# EAGLE design schematic (EAGLE 5.06)
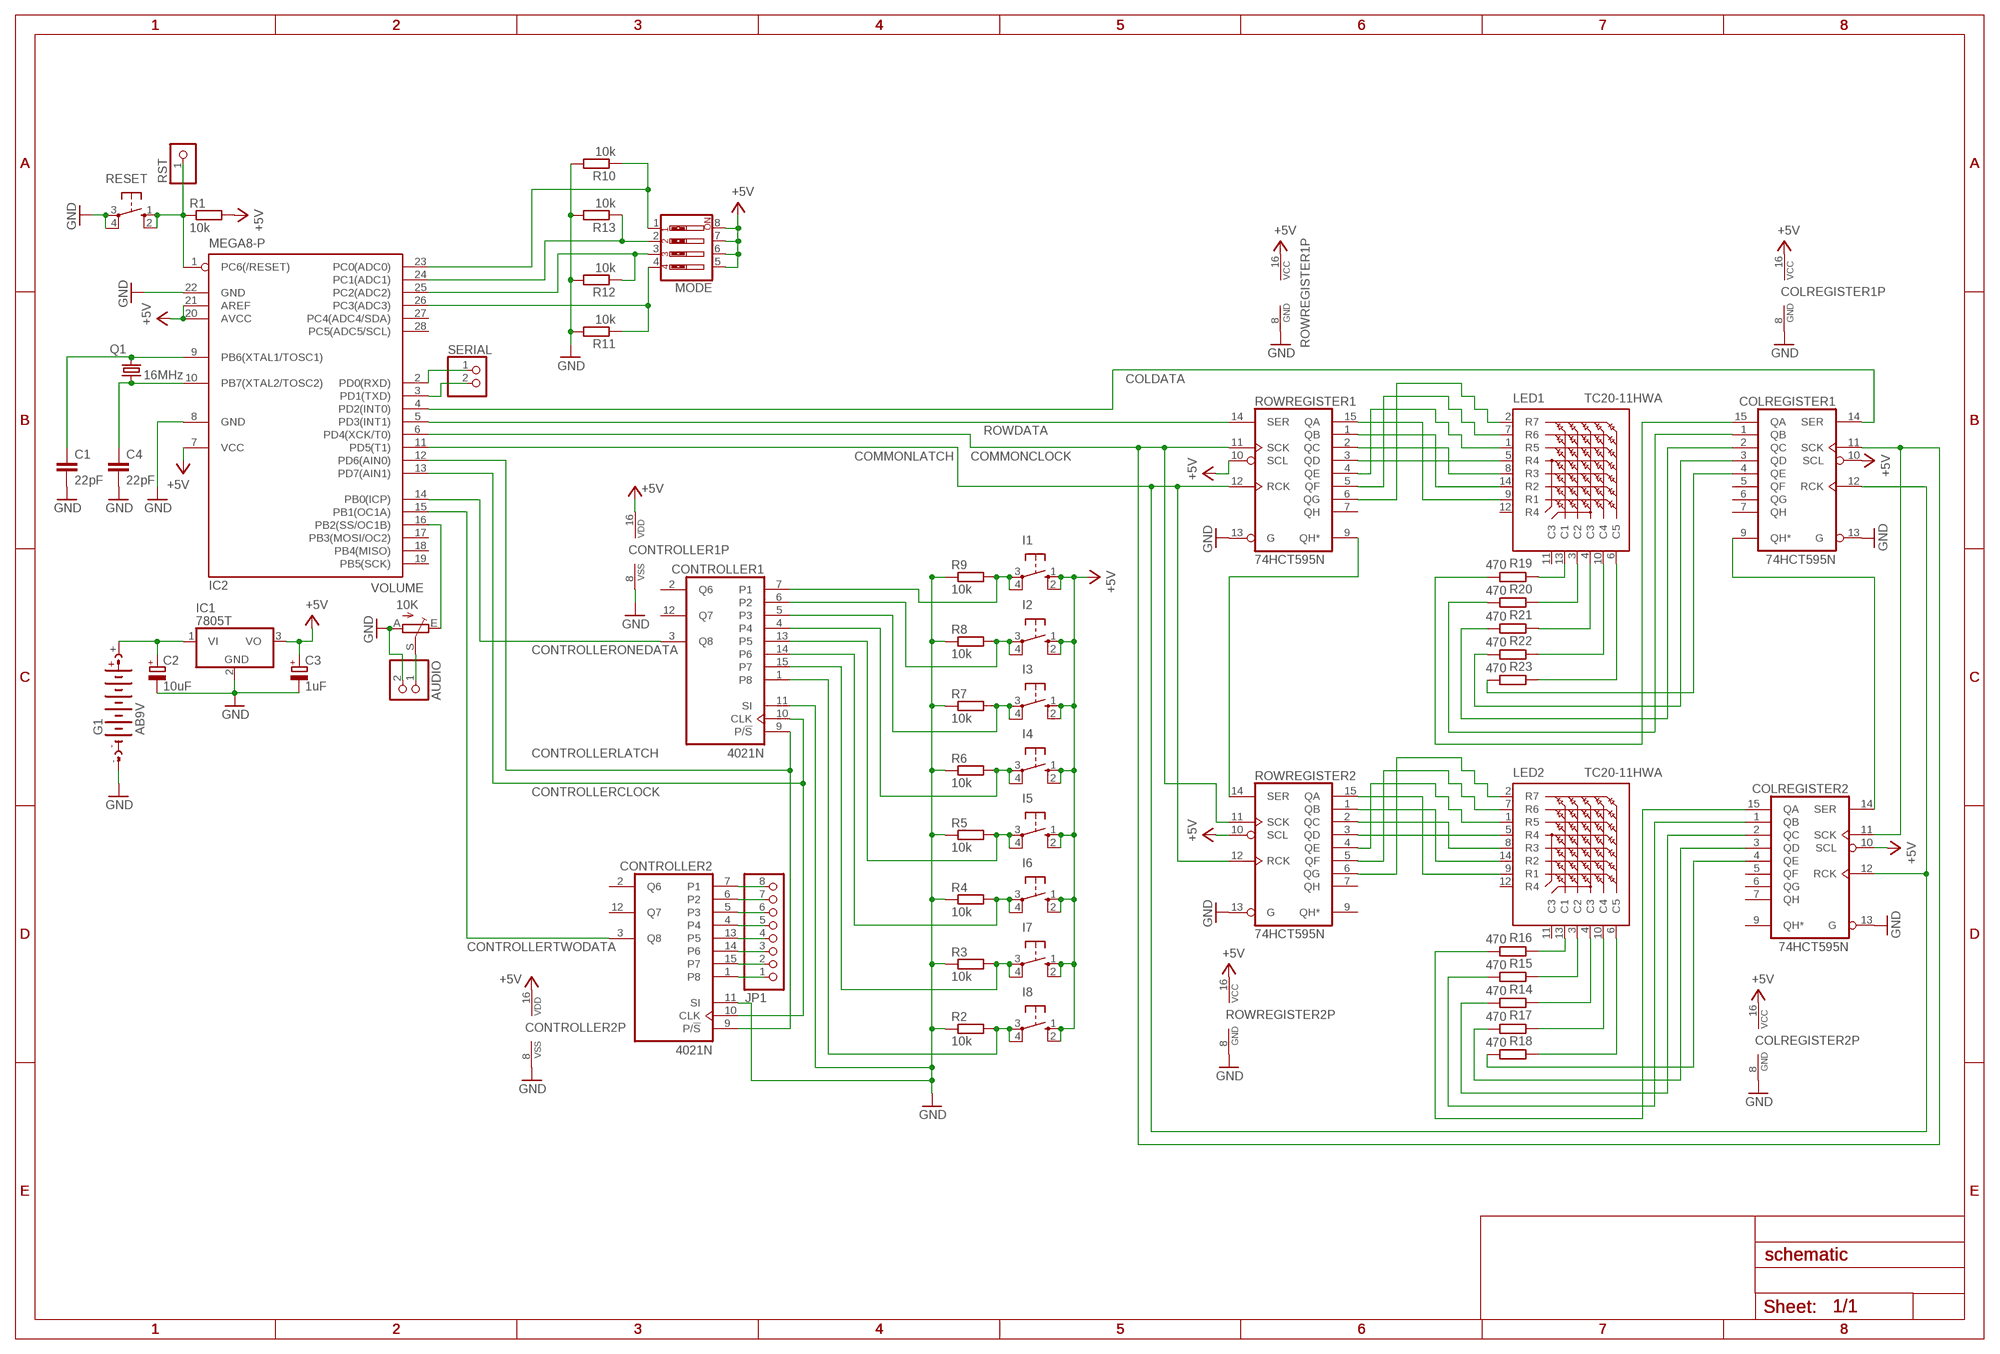
[diagram p0: schematic, sheet 1]

## Parts
AUDIO  PINHD-1X2  [1X02]
C1  22pF  C2,5-3  [C2.5-3]
C2  10uF  CPOL-EUB45181A  [B45181A]
C3  1uF  CPOL-EUB45181A  [B45181A]
C4  22pF  C2,5-3  [C2.5-3]
COLREGISTER1  74HCT595N  [DIL16]
COLREGISTER2  74HCT595N  [DIL16]
CONTROLLER1  4021N  [DIL16]
CONTROLLER2  4021N  [DIL16]
G1  AB9V  [AB9V]
I1  10-XX  [B3F-10XX]
I2  10-XX  [B3F-10XX]
I3  10-XX  [B3F-10XX]
I4  10-XX  [B3F-10XX]
I5  10-XX  [B3F-10XX]
I6  10-XX  [B3F-10XX]
I7  10-XX  [B3F-10XX]
I8  10-XX  [B3F-10XX]
IC1  7805T  [TO220H]
IC2  MEGA8-P  [DIL28-3]
JP1  PINHD-1X8  [1X08]
LED1  TC20-11HWA  [TA20-11HWA]
LED2  TC20-11HWA  [TA20-11HWA]
MODE  SW_DIP-4  [EDG-04]
Q1  16MHz  CRYSTALHC49U70  [HC49U70]
R1  10k  R-EU_0204/7  [0204/7]
R2  10k  R-EU_0204/7  [0204/7]
R3  10k  R-EU_0204/7  [0204/7]
R4  10k  R-EU_0204/7  [0204/7]
R5  10k  R-EU_0204/7  [0204/7]
R6  10k  R-EU_0204/7  [0204/7]
R7  10k  R-EU_0204/7  [0204/7]
R8  10k  R-EU_0204/7  [0204/7]
R9  10k  R-EU_0204/7  [0204/7]
R10  10k  R-EU_0204/7  [0204/7]
R11  10k  R-EU_0204/7  [0204/7]
R12  10k  R-EU_0204/7  [0204/7]
R13  10k  R-EU_0204/7  [0204/7]
R14  470  R-EU_0204/7  [0204/7]
R15  470  R-EU_0204/7  [0204/7]
R16  470  R-EU_0204/7  [0204/7]
R17  470  R-EU_0204/7  [0204/7]
R18  470  R-EU_0204/7  [0204/7]
R19  470  R-EU_0204/7  [0204/7]
R20  470  R-EU_0204/7  [0204/7]
R21  470  R-EU_0204/7  [0204/7]
R22  470  R-EU_0204/7  [0204/7]
R23  470  R-EU_0204/7  [0204/7]
RESET  10-XX  [B3F-10XX]
ROWREGISTER1  74HCT595N  [DIL16]
ROWREGISTER2  74HCT595N  [DIL16]
RST  PINHD-1X1  [1X01]
SERIAL  PINHD-1X2  [1X02]
VOLUME  10K  TRIM_EU-S63S  [S63S]

## Nets
AUDIO: AUDIO.1 VOLUME.S
COLDATA: COLREGISTER1.14(SER) IC2.4(PD2(INT0))
COMMONCLOCK: COLREGISTER1.11(SCK) COLREGISTER2.11(SCK) IC2.6(PD4(XCK/T0)) ROWREGISTER1.11(SCK) ROWREGISTER2.11(SCK)
COMMONLATCH: COLREGISTER1.12(RCK) COLREGISTER2.12(RCK) IC2.11(PD5(T1)) ROWREGISTER1.12(RCK) ROWREGISTER2.12(RCK)
CONTROLLERCLOCK: CONTROLLER1.10(CLK) CONTROLLER2.10(CLK) IC2.13(PD7(AIN1))
CONTROLLERLATCH: CONTROLLER1.9(P/!S) CONTROLLER2.9(P/!S) IC2.12(PD6(AIN0))
CONTROLLERONEDATA: CONTROLLER1.3(Q8) IC2.14(PB0(ICP))
CONTROLLERTWODATA: CONTROLLER2.3(Q8) IC2.15(PB1(OC1A))
GND: AUDIO.2 C1.2 C2.- C3.- C4.2 COLREGISTER1.8(GND) COLREGISTER1.13(G) COLREGISTER2.8(GND) COLREGISTER2.13(G) CONTROLLER1.8(VSS) CONTROLLER1.11(SI) CONTROLLER2.8(VSS) CONTROLLER2.11(SI) G1.- IC1.2(GND) IC2.8(GND) IC2.22(GND) R2.1 R3.1 R4.1 R5.1 R6.1 R7.1 R8.1 R9.1 R10.2 R11.2 R12.2 R13.2 RESET.3(P) RESET.4(P1) ROWREGISTER1.8(GND) ROWREGISTER1.13(G) ROWREGISTER2.8(GND) ROWREGISTER2.13(G) VOLUME.A
N$1: C1.1 IC2.9(PB6(XTAL1/TOSC1)) Q1.2
N$2: C2.+ G1.+ IC1.1(VI)
N$3: C4.1 IC2.10(PB7(XTAL2/TOSC2)) Q1.1
N$4: LED2.6(C5) R18.1
N$5: IC2.2(PD0(RXD)) SERIAL.1
N$6: CONTROLLER2.7(P1) JP1.8
N$7: CONTROLLER2.6(P2) JP1.7
N$8: CONTROLLER2.5(P3) JP1.6
N$9: CONTROLLER2.4 JP1.5
N$10: CONTROLLER2.13(P5) JP1.4
N$11: CONTROLLER2.14(P6) JP1.3
N$12: CONTROLLER1.1(P8) I8.3(P) I8.4(P1) R2.2
N$13: CONTROLLER1.15(P7) I7.3(P) I7.4(P1) R3.2
N$14: CONTROLLER1.14(P6) I6.3(P) I6.4(P1) R4.2
N$15: CONTROLLER1.13(P5) I5.3(P) I5.4(P1) R5.2
N$16: CONTROLLER1.4 I4.3(P) I4.4(P1) R6.2
N$17: CONTROLLER1.5(P3) I3.3(P) I3.4(P1) R7.2
N$18: CONTROLLER1.6(P2) I2.3(P) I2.4(P1) R8.2
N$19: CONTROLLER1.7(P1) I1.3(P) I1.4(P1) R9.2
N$20: CONTROLLER2.15(P7) JP1.2
N$21: CONTROLLER2.1(P8) JP1.1
N$22: ROWREGISTER1.9(QH*) ROWREGISTER2.14(SER)
N$23: LED2.10(C4) R17.1
N$24: LED2.4(C3) R14.1
N$25: LED2.3(C2) R15.1
N$26: LED1.9(R1) ROWREGISTER1.15(QA)
N$27: LED1.14(R2) ROWREGISTER1.1(QB)
N$28: LED1.8(R3) ROWREGISTER1.2(QC)
N$29: LED1.5(R4) ROWREGISTER1.3(QD)
N$30: LED1.1(R5) ROWREGISTER1.4(QE)
N$31: LED1.7(R6) ROWREGISTER1.5(QF)
N$32: LED1.2(R7) ROWREGISTER1.6(QG)
N$33: LED2.9(R1) ROWREGISTER2.15(QA)
N$34: LED2.14(R2) ROWREGISTER2.1(QB)
N$35: LED2.8(R3) ROWREGISTER2.2(QC)
N$36: LED2.5(R4) ROWREGISTER2.3(QD)
N$37: LED2.1(R5) ROWREGISTER2.4(QE)
N$38: LED2.7(R6) ROWREGISTER2.5(QF)
N$39: LED2.2(R7) ROWREGISTER2.6(QG)
N$40: COLREGISTER1.9(QH*) COLREGISTER2.14(SER)
N$41: LED2.13(C1) R16.1
N$42: LED1.13(C1) R19.1
N$43: LED1.3(C2) R20.1
N$44: COLREGISTER1.15(QA) R19.2
N$45: COLREGISTER1.1(QB) R20.2
N$46: COLREGISTER1.2(QC) R21.2
N$47: COLREGISTER1.3(QD) R22.2
N$48: COLREGISTER1.4(QE) R23.2
N$49: COLREGISTER2.4(QE) R18.2
N$50: COLREGISTER2.3(QD) R17.2
N$51: COLREGISTER2.2(QC) R14.2
N$52: COLREGISTER2.1(QB) R15.2
N$53: COLREGISTER2.15(QA) R16.2
N$54: LED1.4(C3) R21.1
N$55: LED1.10(C4) R22.1
N$56: LED1.6(C5) R23.1
N$57: IC2.3(PD1(TXD)) SERIAL.2
N$61: IC2.23(PC0(ADC0)) MODE.1 R10.1
N$62: IC2.24(PC1(ADC1)) MODE.2 R13.1
N$63: IC2.25(PC2(ADC2)) MODE.3 R12.1
N$64: IC2.26(PC3(ADC3)) MODE.4 R11.1
N$65: IC2.16(PB2(SS/OC1B)) VOLUME.E
NOTHING: IC2.1(PC6(/RESET)) R1.1 RESET.1(S) RESET.2(S1) RST.1
ROWDATA: IC2.5(PD3(INT1)) ROWREGISTER1.14(SER)
V+: C3.+ COLREGISTER1.10(SCL) COLREGISTER1.16(VCC) COLREGISTER2.10(SCL) COLREGISTER2.16(VCC) CONTROLLER1.16(VDD) CONTROLLER2.16(VDD) I1.1(S) I1.2(S1) I2.1(S) I2.2(S1) I3.1(S) I3.2(S1) I4.1(S) I4.2(S1) I5.1(S) I5.2(S1) I6.1(S) I6.2(S1) I7.1(S) I7.2(S1) I8.1(S) I8.2(S1) IC1.3(VO) IC2.7(VCC) IC2.20(AVCC) IC2.21(AREF) MODE.5 MODE.6 MODE.7 MODE.8 R1.2 ROWREGISTER1.10(SCL) ROWREGISTER1.16(VCC) ROWREGISTER2.10(SCL) ROWREGISTER2.16(VCC) ; supply symbol labelled +5V
Unconnected: COLREGISTER1.5(QF) COLREGISTER1.6(QG) COLREGISTER1.7(QH) COLREGISTER2.5(QF) COLREGISTER2.6(QG) COLREGISTER2.7(QH) COLREGISTER2.9(QH*) CONTROLLER1.2(Q6) CONTROLLER1.12(Q7) CONTROLLER2.2(Q6) CONTROLLER2.12(Q7) IC2.17(PB3(MOSI/OC2)) IC2.18(PB4(MISO)) IC2.19(PB5(SCK)) IC2.27(PC4(ADC4/SDA)) IC2.28(PC5(ADC5/SCL)) LED1.11(C3) LED1.12(R4) LED2.11(C3) LED2.12(R4) ROWREGISTER1.7(QH) ROWREGISTER2.7(QH) ROWREGISTER2.9(QH*)

## Library data of the parts
AUDIO SERIAL = pinhead:PINHD-1X2: PIN HEADER
C1 C4 = capacitor-wima:C: CAPACITOR naming: grid - package width
C2 C3 = resistor:CPOL-EU: POLARIZED CAPACITOR, European symbol
COLREGISTER1 COLREGISTER2 ROWREGISTER1 ROWREGISTER2 = 74xx-eu:74*595: 8-bit SHIFT REGISTER, output latch
CONTROLLER1 CONTROLLER2 = 40xx:4021: 8-bit static SHIFT REGISTER
G1 = battery:AB9V: 9-V BATTERY CLIP
I1-I8 RESET = switch-omron:10-XX: OMRON SWITCH; MPN: B3F-1000; OC_FARNELL: 176432; OC_NEWARK: 36M3542
IC1 = linear:78*: Positive VOLTAGE REGULATOR Source: http://cache.national.com/ds/LM/LM78L05.pdf http://www.fairchildsemi.com/ds/LM/LM7805.pdf
IC2 = atmel:MEGA8-P: MICROCONTROLLER 8 Kbytes FLASH, 1 kbytes SRAM, 512 bytes EEPROM, USART, 4-channel 10 bit ADC, 2-channel 8 bit ADC Pin compatible with Atmega48, ATMega88, ATMega168 Source: avr.lbr; OC_FARNELL: unknown; OC_NEWARK: unknown
JP1 = pinhead:PINHD-1X8: PIN HEADER
LED1 LED2 = display-kingbright:TC20-11HWA: 50mm (2.0 INCH) 5x7 DOT MATRIX DISPLAY Source: http://www.kingbright.com/manager/upload/pdf/TC20-11EWA(Ver1189410378.9); OC_FARNELL: unknown; OC_NEWARK: unknown
MODE = special:SW_DIP-4: DIP SWITCH
Q1 = crystal:CRYSTAL: CRYSTAL; OC_FARNELL: unknown; OC_NEWARK: unknown
R1-R23 = resistor:R-EU_: RESISTOR, European symbol
RST = pinhead:PINHD-1X1: PIN HEADER
VOLUME = pot:TRIM_EU-: POTENTIOMETER

## Net classes
0 default: width 0.61 mm

## Board
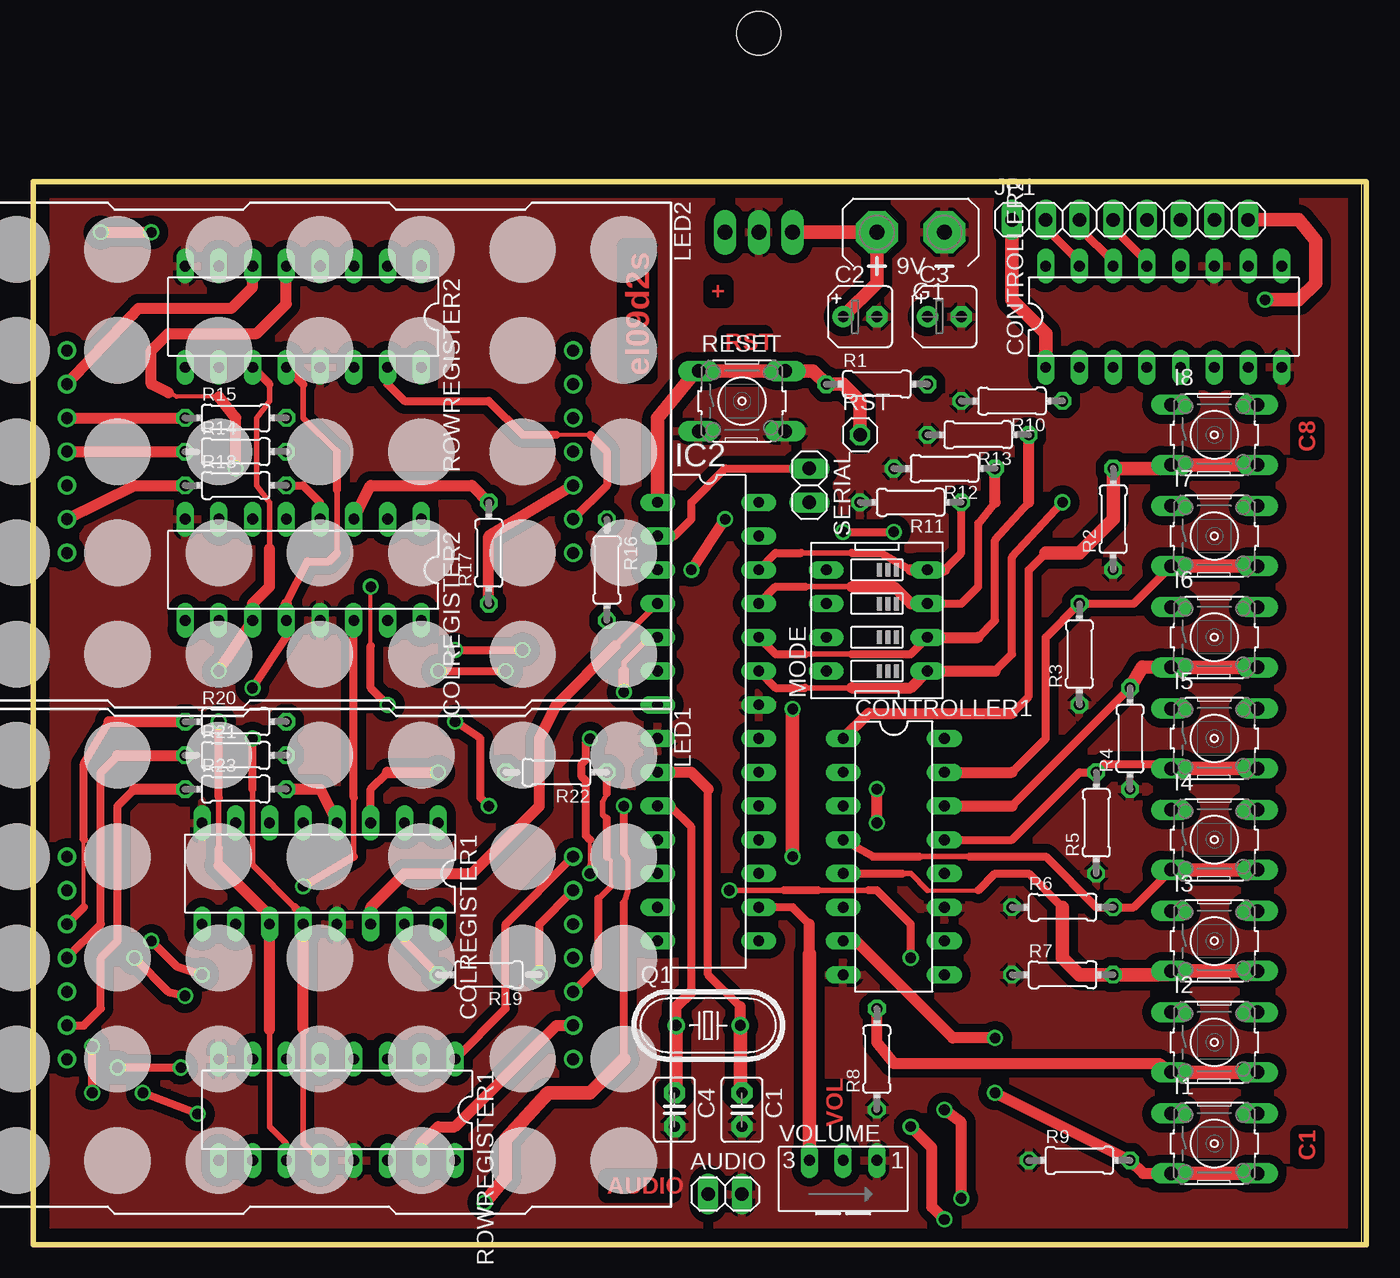
[diagram p1: board, top side]
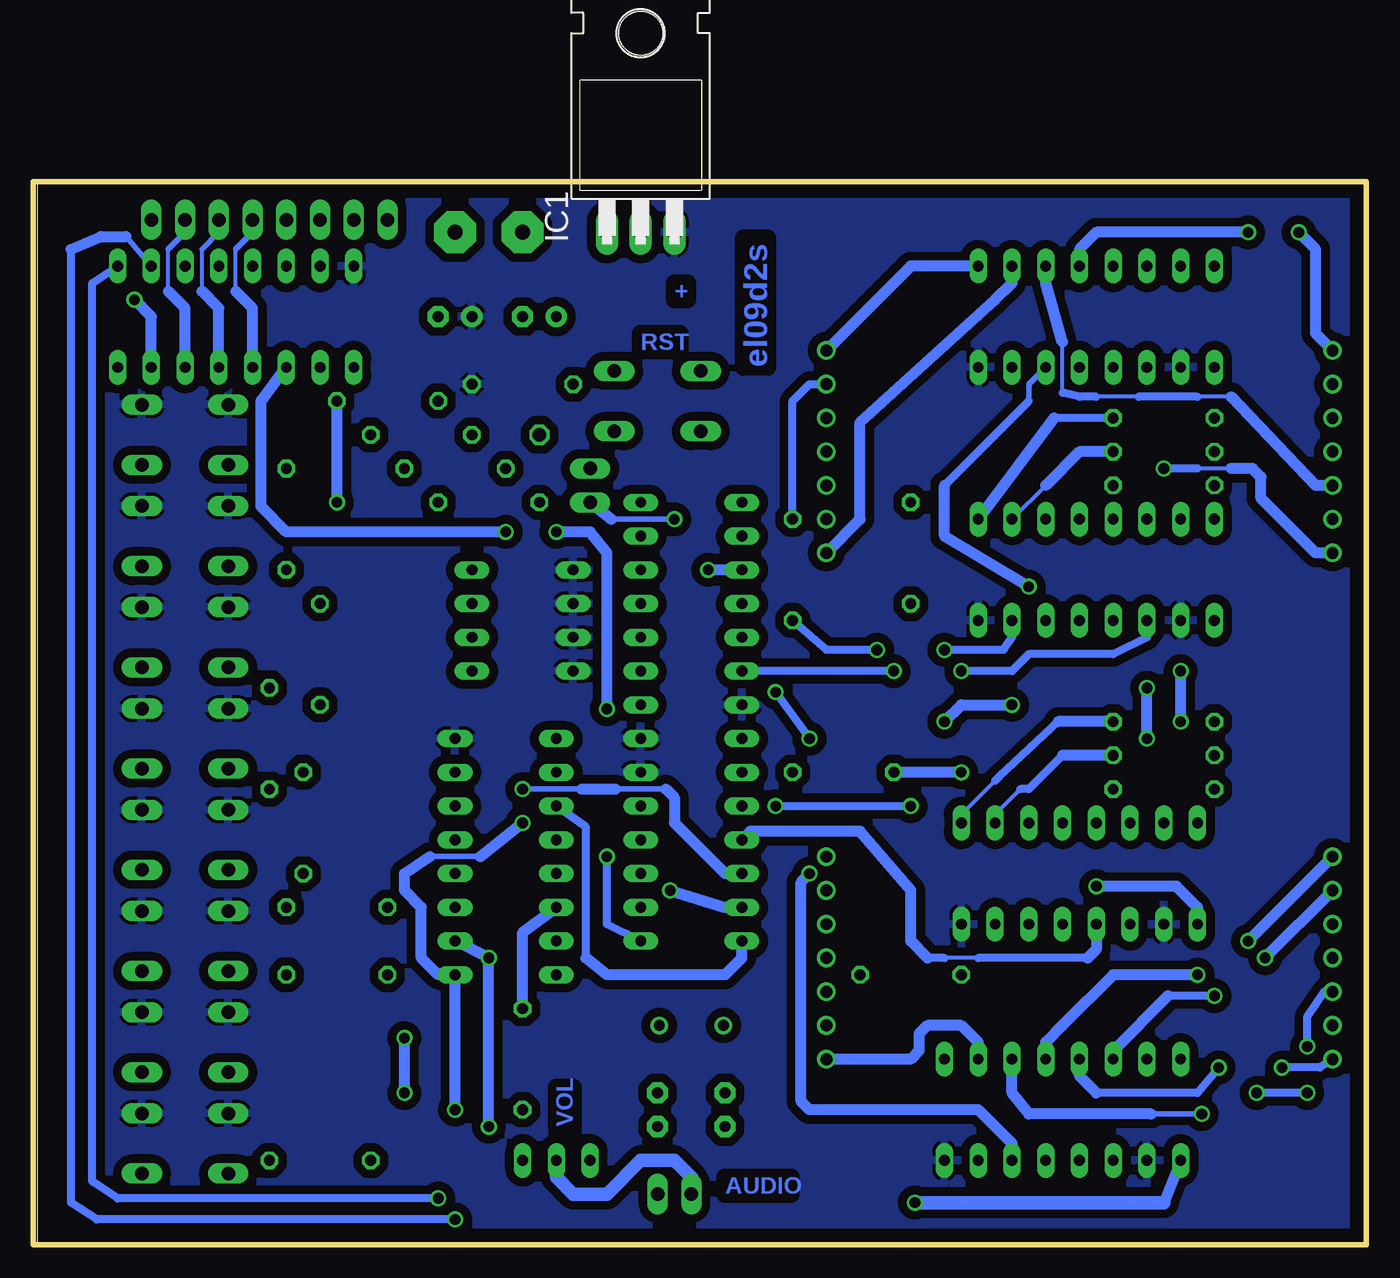
[diagram p2: board, bottom side, seen from below]

Size 100.33 x 80.01 mm. Coordinates in mm from the lower left corner, seen from the top.
Outline: 0,0 100,0 100,80 0,80
Outline: 0,80 0,80.01 100.33,80.01 100.33,0 0,0
Outline: 0,80 0,0
Copper layers (1*16): Top 0.035mm / dielectric 1.5mm / Bottom 0.035mm
Design rules "default *": minimum track width 10mil, minimum drill 24mil, track to track 26mil, track to pad 16mil, pad to pad 8mil, via to via 8mil, smd to smd 8mil, copper to edge 40mil, drill to drill 8mil, minimum pad ring 10mil, minimum via ring 8mil, stop-mask expansion 4mil, vias tented up to drill 0mil, thermal gap 10mil

### Footprints (pad centres in the part's own frame; a part is rotated, then mirrored left to right if it is on the bottom)
1X02 = drill 1.016 long: 1 -1.27,0; 2 1.27,0
C2.5-3 = drill 0.813 pad 1.6 octagon: 1 -1.27,0; 2 1.27,0
B45181A = drill 0.813 pad 1.6 round: + -1.27,0 | drill 0.813 pad 1.6 octagon: - 1.27,0
DIL16 = drill 0.813 long: 1 -8.89,-3.81; 2 -6.35,-3.81; 3 -3.81,-3.81; 4 -1.27,-3.81; 5 1.27,-3.81; 6 3.81,-3.81; 7 6.35,-3.81; 8 8.89,-3.81; 9 8.89,3.81; 10 6.35,3.81; 11 3.81,3.81; 12 1.27,3.81; 13 -1.27,3.81; 14 -3.81,3.81; 15 -6.35,3.81; 16 -8.89,3.81
AB9V = drill 1.118 pad 3.15 octagon: + 0,2.54; - 0,-2.54
B3F-10XX = drill 1.016 long: 1 -3.251,2.261; 2 3.251,2.261; 3 -3.251,-2.261; 4 3.251,-2.261
TO220H = drill 1.118 long: 1 -2.54,-10.16; 2 0,-10.16; 3 2.54,-10.16 | hole 3.302: 0,4.826
DIL28-3 = drill 0.813 long: 1 -16.51,-3.81; 2 -13.97,-3.81; 3 -11.43,-3.81; 4 -8.89,-3.81; 5 -6.35,-3.81; 6 -3.81,-3.81; 7 -1.27,-3.81; 8 1.27,-3.81; 9 3.81,-3.81; 10 6.35,-3.81; 11 8.89,-3.81; 12 11.43,-3.81; 13 13.97,-3.81; 14 16.51,-3.81; 15 16.51,3.81; 16 13.97,3.81; 17 11.43,3.81; 18 8.89,3.81; 19 6.35,3.81; 20 3.81,3.81; 21 1.27,3.81; 22 -1.27,3.81; 23 -3.81,3.81; 24 -6.35,3.81; 25 -8.89,3.81; 26 -11.43,3.81; 27 -13.97,3.81; 28 -16.51,3.81
1X08 = drill 1.016 long: 1 -8.89,0; 2 -6.35,0; 3 -3.81,0; 4 -1.27,0; 5 1.27,0; 6 3.81,0; 7 6.35,0; 8 8.89,0
TA20-11HWA = drill 0.9 pad 1.4 round: 1 -7.62,-19.05; 2 -5.08,-19.05; 3 -2.54,-19.05; 4 0,-19.05; 5 2.54,-19.05; 6 5.08,-19.05; 7 7.62,-19.05; 8 7.62,19.05; 9 5.08,19.05; 10 2.54,19.05; 11 0,19.05; 12 -2.54,19.05; 13 -5.08,19.05; 14 -7.62,19.05
EDG-04 = drill 0.813 long: 1 -3.81,-3.81; 2 -1.27,-3.81; 3 1.27,-3.81; 4 3.81,-3.81; 5 3.81,3.81; 6 1.27,3.81; 7 -1.27,3.81; 8 -3.81,3.81
HC49U70 = drill 0.813 round: 1 -2.413,0; 2 2.413,0
0204/7 = drill 0.813 octagon: 1 -3.81,0; 2 3.81,0
1X01 = drill 1.016 octagon: 1 0,0
S63S = drill 0.813 long: A 2.54,1.27; E -2.54,1.27; S 0,1.27

### Placement (x,y rotation side)
AUDIO  52.07,3.81 0 top
C1  53.34,10.16 270 top
C2  62.23,69.85 0 top
C3  68.58,69.85 0 top
C4  48.26,10.16 270 top
COLREGISTER1  21.59,27.94 180 top
COLREGISTER2  20.32,50.8 180 top
CONTROLLER1  64.77,29.21 270 top
CONTROLLER2  85.09,69.85 0 top
G1  66.04,76.2 90 top
I1  88.9,7.62 0 top
I2  88.9,15.24 0 top
I3  88.9,22.86 0 top
I4  88.9,30.48 0 top
I5  88.9,38.1 0 top
I6  88.9,45.72 0 top
I7  88.9,53.34 0 top
I8  88.9,60.96 0 top
IC1  54.61,86.36 0 bottom
IC2  50.8,39.37 270 top
JP1  82.55,77.15 0 top
LED1  21.59,21.59 270 top
LED2  21.59,59.69 270 top
MODE  63.5,46.99 90 top
Q1  50.8,16.51 0 top
R1  63.5,64.77 0 top
R2  81.28,54.61 90 top
R3  78.74,44.45 90 top
R4  82.55,38.1 90 top
R5  80.01,31.75 90 top
R6  77.47,25.4 0 top
R7  77.47,20.32 0 top
R8  63.5,13.97 90 top
R9  78.74,6.35 0 top
R10  73.66,63.5 180 top
R11  66.04,55.88 180 top
R12  68.58,58.42 180 top
R13  71.12,60.96 180 top
R14  15.24,59.69 0 top
R15  15.24,62.23 0 top
R16  43.18,50.8 270 top
R17  34.29,52.07 90 top
R18  15.24,57.15 0 top
R19  34.29,20.32 180 top
R20  15.24,39.37 0 top
R21  15.24,36.83 0 top
R22  39.37,35.56 180 top
R23  15.24,34.29 0 top
RESET  53.34,63.5 0 top
ROWREGISTER1  22.86,10.16 180 top
ROWREGISTER2  20.32,69.85 180 top
RST  62.23,60.96 0 top
SERIAL  58.42,57.15 270 top
VOLUME  60.96,5.08 0 top

### Tracks (layer width: path | path; a pad name or v marks a point on that pad's centre or on a via)
AUDIO
  Bottom 1.016: AUDIO.1 50.8,5.08 52.07,6.35 54.61,6.35 57.15,3.81 59.69,3.81 60.96,5.08 VOLUME.S
COLDATA
  Top 0.406: 43.81,45.09 IC2.4
  Top 0.813: COLREGISTER1.14 25.4,25.4 27.94,27.94 33.02,27.94 38.1,33.02 38.1,38.1 39.37,40.64 43.81,45.09
COMMONCLOCK  (via drill 0.8)
  Top 0.406: ROWREGISTER1.11 19.05,7.62 17.78,8.89 17.78,16.19 | 13.97,29.84 13.97,33.66 | 17.78,64.77 17.78,63.5 16.83,62.23 16.83,57.15 17.78,55.88 17.78,52.39
  Top 0.61: 17.78,64.77 ROWREGISTER2.11 | v30.48,43.18 v35.56,43.18 | 13.97,33.66 v13.97,39.37 | 13.97,28.57 13.97,29.84
  Top 0.813: v13.97,43.18 COLREGISTER2.11 16.51,48.26 17.78,49.53 17.78,52.39 | 13.97,28.57 17.78,24.77 COLREGISTER1.11 17.78,16.19
  Bottom 0.61: COLREGISTER2.11 16.51,45.72 19.05,44.45 25.4,44.45 26.67,43.18 v30.48,43.18 | v35.56,43.18 IC2.6
  Bottom 0.813: v13.97,39.37 v13.97,43.18
COMMONLATCH  (via drill 0.8)
  Top 0.406: 20.32,64.77 20.32,62.23 22.86,59.69 | ROWREGISTER1.12 20.32,7.62 20.32,16.19 | 16.51,34.29 16.51,28.57 19.68,25.4 | 22.86,52.07 22.86,56.83
  Top 0.61: 20.32,64.77 ROWREGISTER2.12 | COLREGISTER2.12 19.05,45.72 v16.51,41.91 | 16.51,34.29 v16.51,38.1 | COLREGISTER1.12 20.32,24.77 19.68,25.4 | 22.86,56.83 22.86,59.69 | 22.86,52.07 22.23,51.44 20.64,51.44 19.05,48.26
  Top 0.813: COLREGISTER2.12 19.05,48.26 | 20.32,16.19 COLREGISTER1.12
  Bottom 0.305: 29.21,21.59 31.75,21.59
  Bottom 0.61: 20.95,21.59 29.21,21.59 | 31.75,21.59 33.02,21.59
  Bottom 0.813: 33.02,21.59 34.29,22.86 34.29,26.67 38.1,31.11 46.35,31.11 IC2.11 | v16.51,38.1 v16.51,41.91 | 20.95,21.59 20.32,22.23 COLREGISTER1.12
CONTROLLERCLOCK  (via drill 0.8)
  Top 0.406: 56.52,26.67 v52.39,26.67 | 62.87,26.67 59.05,26.67
  Top 0.61: v66.04,21.59 66.04,24.13 63.5,26.67 62.87,26.67 | 59.05,26.67 56.52,26.67
  Top 0.813: v66.04,8.89 67.63,7.3 67.63,2.86 v68.58,1.91
  Bottom 0.406: 93.34,75.88 CONTROLLER2.10
  Bottom 0.61: v68.58,1.91 95.57,1.91 97.47,3.17 97.47,74.93
  Bottom 0.813: CONTROLLER1.10 v66.04,21.59 v66.04,8.89 | 93.34,75.88 95.25,75.88 97.47,74.93 | IC2.13 48.26,25.4 v52.39,26.67
CONTROLLERLATCH  (via drill 0.8)
  Top 0.813: v63.5,31.75 v63.5,34.29 | v68.58,10.16 69.85,9.21 v69.85,3.49
  Bottom 0.406: 56.52,34.29 52.7,34.29 | v63.5,34.29 59.05,34.29 | 70.48,29.21 66.67,29.21
  Bottom 0.61: v69.85,3.49 93.98,3.49 95.89,4.76 95.89,72.39 CONTROLLER2.9
  Bottom 0.813: 70.48,29.21 72.39,27.94 72.39,26.67 71.12,25.4 71.12,21.59 69.85,20.32 CONTROLLER1.9 v68.58,10.16 | IC2.12 48.26,27.94 52.07,31.75 52.07,33.66 52.7,34.29 | 66.67,29.21 v63.5,31.75 | 59.05,34.29 56.52,34.29
CONTROLLERONEDATA
  Bottom 0.61: CONTROLLER1.3 58.74,31.43 58.74,21.59
  Bottom 0.813: IC2.14 46.99,21.59 48.26,20.32 57.15,20.32 58.74,21.59
CONTROLLERTWODATA  (via drill 0.8)
  Top 0.61: v60.96,53.66 v64.77,53.66
  Top 1.016: v57.15,29.21 v57.15,40.32
  Bottom 0.61: IC2.15 57.15,24.13 v57.15,29.21
  Bottom 0.813: v57.15,40.32 57.15,52.07 58.42,53.66 v60.96,53.66 | CONTROLLER2.3 83.19,63.5 83.19,55.56 81.28,53.66 v64.77,53.66
GND
  pour Top (isolate 0.61): 0,80.01 100.33,80.01 100.33,0 0,0
N$1
  Top 0.61: 53.21,11.56 C1.1 | 53.21,17.91 50.8,20.32 50.8,34.29
  Top 0.813: Q1.2 53.21,17.91 | 50.8,34.29 49.53,35.56 IC2.9
  Top 1.016: 53.21,11.56 Q1.2
N$2
  Top 1.016: C2.+ 63.5,72.39 G1.+ IC1.1
N$3
  Top 0.61: C4.1 48.39,11.56 | 49.53,19.05 49.53,31.43 47.94,33.02
  Top 0.813: Q1.1 48.39,17.91 49.53,19.05 | 47.94,33.02 IC2.10
  Top 1.016: 48.39,11.56 Q1.1
N$4
  Top 0.813: R18.1 7.62,57.15 LED2.6
N$5
  Top 0.61: SERIAL.1 52.07,58.42 49.53,55.88 49.53,54.61 48.26,53.34 IC2.2
N$6  (via drill 0.8)
  Top 1.016: JP1.8 95.25,77.15 96.52,75.56 96.52,72.39 95.25,71.12 v92.71,71.12
  Bottom 0.813: v92.71,71.12 91.44,69.85 CONTROLLER2.7
N$7
  Bottom 0.305: 90.17,71.75 90.17,74.93
  Bottom 0.406: 90.17,74.93 88.9,76.2
  Bottom 0.61: 88.9,76.2 JP1.7
  Bottom 0.813: CONTROLLER2.6 88.9,70.48 90.17,71.75
N$8
  Bottom 0.305: 87.63,71.75 87.63,74.93
  Bottom 0.406: 87.63,74.93 86.36,76.2
  Bottom 0.61: 86.36,76.2 JP1.6
  Bottom 0.813: CONTROLLER2.5 86.36,70.48 87.63,71.75
N$9
  Bottom 0.305: 85.09,71.75 85.09,74.93
  Bottom 0.406: 85.09,74.93 83.82,76.2
  Bottom 0.61: 83.82,76.2 JP1.5
  Bottom 0.813: CONTROLLER2.4 83.82,70.48 85.09,71.75
N$10
  Top 0.61: JP1.4 81.28,76.52 83.82,73.98 CONTROLLER2.13
N$11
  Top 0.61: JP1.3 78.74,76.52 81.28,73.98 CONTROLLER2.14
N$12
  Top 0.61: 73.66,40.01 74.93,41.27 74.93,50.8 76.2,52.07
  Top 0.813: CONTROLLER1.1 62.87,40.01 73.66,40.01
  Top 1.016: I8.4 I8.3 85.37,58.42 R2.2 81.28,54.61 78.74,52.07 76.2,52.07
N$13
  Top 0.61: 73.66,35.56 76.2,38.1 76.2,45.72 R3.2 82.83,48.26 I7.3
  Top 0.813: CONTROLLER1.15 73.66,35.56
  Top 1.016: I7.3 I7.4
N$14
  Top 0.61: 73.66,33.02 R4.2
  Top 0.813: CONTROLLER1.14 73.66,33.02
  Top 1.016: I6.4 I6.3 83.46,43.5 R4.2
N$15
  Top 0.61: CONTROLLER1.13 73.66,30.48 78.74,35.56 R5.2 80.64,36.2 85.29,36.2 I5.3
  Top 1.016: I5.3 I5.4
N$16
  Top 0.406: 66.67,29.21 70.48,29.21
  Top 0.61: CONTROLLER1.4 63.18,29.21 66.67,29.21 | I4.3 82.83,25.4 R6.2 80.01,25.4 76.2,29.21 70.48,29.21
  Top 1.016: I4.3 I4.4
N$17
  Top 0.305: 67.31,26.67 71.12,26.67
  Top 0.406: 65.41,27.94 66.04,27.94 67.31,26.67
  Top 0.61: CONTROLLER1.5 65.41,27.94 | 77.47,25.4 74.93,27.94 72.39,27.94 71.12,26.67
  Top 1.016: I3.4 I3.3 85.37,20.32 R7.2 78.74,20.32 77.47,21.59 77.47,25.4
N$18
  Top 0.813: R8.2 63.5,15.24 64.77,13.65 84.77,13.65 I2.3
  Top 1.016: I2.3 I2.4
  Bottom 0.813: R8.2 63.5,23.5 CONTROLLER1.6
N$19  (via drill 0.8)
  Top 0.813: I1.3 83.54,5.36 R9.2 v72.39,11.43 | v72.39,15.56 69.22,15.56 61.91,22.86 CONTROLLER1.7
  Top 1.016: I1.3 I1.4
  Bottom 0.813: v72.39,11.43 v72.39,15.56
N$20
  Top 0.61: JP1.2 76.2,76.52 78.74,73.98 CONTROLLER2.15
N$21
  Top 1.016: JP1.1 73.66,71.12 76.2,68.58 CONTROLLER2.1
N$22  (via drill 0.8)
  Top 0.305: 25.4,45.09 v25.4,49.53
  Top 0.406: 44.45,25.72 44.77,26.67 44.77,28.89 44.45,29.53
  Top 0.61: v26.67,40.64 25.4,41.91 25.4,45.09 | v31.75,39.37 33.66,38.1 33.66,33.66 v34.29,33.02 | 44.45,29.53 v44.45,33.02 | 44.45,13.97 44.45,25.72
  Top 1.016: v33.97,3.17 35.56,5.08 35.56,7.94 38.73,11.43 41.91,11.43 44.45,13.97
  Bottom 0.406: 25.4,63.5 25.4,64.77 ROWREGISTER2.14
  Bottom 0.61: v44.45,33.02 v34.29,33.02 | 31.75,57.15 25.4,63.5
  Bottom 0.813: 31.75,57.15 31.75,53.34 v25.4,49.53 | ROWREGISTER1.9 15.24,3.17 | v26.67,40.64 30.48,40.64 v31.75,39.37
  Bottom 1.016: 15.24,3.17 v33.97,3.17
N$23
  Top 0.813: R17.1 34.29,53.34 LED2.10
N$24
  Top 0.813: LED2.4 R14.1
N$25
  Top 0.813: LED2.3 R15.1
N$26
  Top 0.813: LED1.9 39.37,16.51 31.75,8.89 30.48,8.89 29.21,7.62 ROWREGISTER1.15
N$27
  Top 0.61: ROWREGISTER1.1 35.56,17.78 35.56,24.13 LED1.14
N$28
  Bottom 0.813: LED1.8 34.29,13.97 33.66,14.61 33.66,15.88 33.02,16.51 30.48,16.51 29.21,15.24 ROWREGISTER1.2
N$29  (via drill 0.8)
  Top 0.61: v4.45,11.43 v4.45,14.92 | v8.26,11.43 v12.38,9.84
  Bottom 0.406: v12.38,9.84 16.19,9.84
  Bottom 0.61: v4.45,14.92 4.45,17.14 3.17,19.05 LED1.5 | v4.45,11.43 v8.26,11.43
  Bottom 0.813: ROWREGISTER1.3 26.67,11.43 25.4,9.84 16.19,9.84
N$30  (via drill 0.8)
  Top 0.61: v12.7,20.32 10.79,20.95 v8.89,22.86
  Bottom 0.813: ROWREGISTER1.4 24.13,15.24 22.86,16.51 19.05,20.32 v12.7,20.32 | LED1.1 v8.89,22.86
N$31  (via drill 0.8)
  Top 0.61: v6.35,13.34 v11.11,13.34
  Bottom 0.61: LED1.7 3.49,13.34 v6.35,13.34 | 20.32,11.43 12.7,11.43 v11.11,13.34
  Bottom 0.813: ROWREGISTER1.5 21.59,12.7 20.32,11.43
N$32  (via drill 0.8)
  Top 0.61: v11.43,18.73 10.16,19.05 v7.62,21.59
  Bottom 0.61: v11.43,18.73 14.92,18.73
  Bottom 0.813: LED1.2 v7.62,21.59 | 14.92,18.73 19.05,14.61 ROWREGISTER1.6
N$33
  Top 0.305: 39.37,60.96 41.91,60.96
  Top 0.61: ROWREGISTER2.15 26.67,64.77 27.94,63.5 34.29,63.5 36.83,60.96 39.37,60.96 | 41.91,60.96 43.18,59.69 43.18,57.15 LED2.9
N$34
  Bottom 0.813: ROWREGISTER2.1 34.29,73.66 LED2.14
N$35
  Bottom 0.813: ROWREGISTER2.2 26.67,72.39 27.94,71.12 38.1,61.91 38.1,54.61 LED2.8
N$36
  Bottom 0.305: 22.86,64.14 22.86,67.94 | 17.14,63.82 20.32,63.82 | 10.16,63.82 12.7,63.82
  Bottom 0.61: 22.86,64.14 21.59,63.82 20.32,63.82 | 12.7,63.82 17.14,63.82
  Bottom 0.813: LED2.5 3.81,57.15 10.16,63.82 | 22.86,67.94 24.13,72.39 ROWREGISTER2.3
N$37  (via drill 0.8)
  Top 0.813: v5.08,76.2 v8.89,76.2
  Bottom 0.813: ROWREGISTER2.4 21.59,74.93 20.32,76.2 v8.89,76.2 | LED2.1 3.81,68.58 3.81,74.93 v5.08,76.2
N$38  (via drill 0.8)
  Top 0.305: 10.16,64.14 10.79,63.82 13.97,63.82
  Top 0.813: 10.16,64.14 8.89,64.77 8.89,67.31 10.16,68.58 16.83,68.58 19.05,70.8 ROWREGISTER2.5 | 13.97,63.82 15.24,62.23 v15.24,58.42
  Bottom 0.305: 10.16,58.42 12.7,58.42
  Bottom 0.61: 12.7,58.42 v15.24,58.42
  Bottom 0.813: LED2.7 3.81,52.07 7.94,56.2 7.94,57.78 8.57,58.42 10.16,58.42
N$39
  Top 0.813: LED2.2 7.94,70.48 13.34,70.48 14.92,70.48 16.51,72.07 ROWREGISTER2.6
N$40  (via drill 0.8)
  Top 0.406: 24.13,29.21 24.13,33.66
  Top 0.61: v20.32,26.99 24.13,29.21 | 24.13,33.66 COLREGISTER2.14
  Bottom 0.813: COLREGISTER1.9 12.7,25.4 14.29,26.99 v20.32,26.99
N$41
  Bottom 0.61: R16.1 43.18,63.5 41.91,64.77 LED2.13
N$42
  Top 0.61: R19.1 38.1,24.13 LED1.13
N$43
  Top 0.305: 3.81,25.4 3.81,30.48
  Top 0.61: 5.71,39.37 3.81,36.2 3.81,30.48 | LED1.3 3.81,25.4
  Top 0.813: 5.71,39.37 R20.1
N$44
  Top 0.61: COLREGISTER1.15 27.94,22.86 R19.2
N$45
  Bottom 0.305: 27.94,34.92 30.48,32.38 COLREGISTER1.1
  Bottom 0.61: 23.18,39.37 27.62,35.24 27.94,34.92
  Bottom 0.813: R20.2 23.18,39.37
N$46
  Bottom 0.305: 26.04,34.29 27.94,32.38 COLREGISTER1.2
  Bottom 0.61: 22.86,36.83 25.4,34.29 26.04,34.29
  Bottom 0.813: R21.2 22.86,36.83
N$47  (via drill 0.8)
  Top 0.61: COLREGISTER1.3 25.4,34.29 26.67,35.56
  Top 0.813: 26.67,35.56 v30.48,35.56
  Bottom 0.813: v30.48,35.56 R22.2
N$48
  Top 0.813: R23.2 21.59,34.29 COLREGISTER1.4
N$49
  Top 0.61: R18.2 20.32,57.15 21.59,55.88 COLREGISTER2.4
N$50
  Top 0.813: COLREGISTER2.3 25.4,57.15 33.02,57.15 R17.2
N$51
  Bottom 0.305: 24.13,57.15 COLREGISTER2.2
  Bottom 0.813: R14.2 21.59,59.69 24.13,57.15
N$52
  Bottom 0.61: R15.2 23.5,62.23
  Bottom 0.813: 23.5,62.23 COLREGISTER2.1
N$53  (via drill 0.8)
  Top 0.61: v31.75,44.77 v36.83,44.77
  Bottom 0.61: COLREGISTER2.15 26.67,45.72 27.3,44.77 v31.75,44.77 | R16.2 40.64,44.77 v36.83,44.77
N$54
  Top 0.61: LED1.4 5.08,24.13 5.08,35.56 6.35,36.83
  Top 0.813: 6.35,36.83 R21.1
N$55
  Top 0.305: 43.5,26.99 43.5,28.89 43.18,29.21
  Top 0.406: 42.55,26.04 43.5,26.99 | 43.18,32.07 42.86,32.38 42.86,33.34 43.18,33.97
  Top 0.61: 43.18,29.21 43.18,32.07 | 43.18,33.97 R22.1 | 42.55,26.04 42.55,20.95 LED1.10
N$56
  Top 0.61: 7.62,34.29 6.35,33.02 6.35,22.86 5.08,21.59 5.08,17.78 3.81,16.51 LED1.6
  Top 0.813: 7.62,34.29 R23.1
N$57  (via drill 0.8)
  Top 0.813: v49.53,50.8 v52.07,54.61
  Bottom 0.406: v52.07,54.61 56.83,54.61
  Bottom 0.813: 56.83,54.61 SERIAL.2 | IC2.3 v49.53,50.8
N$61  (via drill 0.8)
  Top 0.406: 58.1,41.91 61.59,41.91
  Top 0.61: IC2.23 55.88,41.91 58.1,41.91 | v77.47,55.88 73.66,51.75 73.66,44.45 72.39,43.18
  Top 0.813: 72.39,43.18 MODE.1 66.04,41.91 61.59,41.91
  Bottom 0.813: v77.47,55.88 R10.1
N$62
  Top 0.406: 58.1,44.45 61.59,44.45
  Top 0.61: MODE.2 66.04,44.45 61.59,44.45 | IC2.24 55.88,44.45 58.1,44.45 | 74.93,55.88 72.39,53.02 72.39,46.99 71.12,45.72
  Top 0.813: 74.93,55.88 R13.1 | MODE.2 71.12,45.72
N$63
  Top 0.406: 58.1,49.53 61.59,49.53
  Top 0.61: IC2.25 55.88,49.53 58.1,49.53 | 72.39,55.88 71.12,54.29 71.12,49.53 69.85,48.26 MODE.3
  Top 0.813: MODE.3 66.04,48.26 64.77,49.53 61.59,49.53 | 72.39,55.88 R12.1
N$64
  Top 0.406: 57.78,52.07 61.59,52.07
  Top 0.61: 66.04,50.8 63.82,52.07 61.59,52.07 | IC2.26 55.88,52.07 57.78,52.07 | 68.58,50.8 69.85,52.07 R11.1
  Top 0.813: 66.04,50.8 MODE.4 68.58,50.8
N$65
  Top 0.61: 58.42,24.13 57.15,25.4 IC2.16
  Top 0.813: 58.42,21.91 58.42,24.13
  Top 1.016: VOLUME.E 58.42,21.91
NOTHING
  Top 1.016: IC2.1 46.99,62.23 49.85,65.72 RESET.1 RESET.2 58.7,65.76 R1.1 60.96,64.77 62.23,63.5 RST.1
ROWDATA  (via drill 0.8)
  Top 0.305: 41.91,28.57 41.91,30.48
  Top 0.406: IC2.5 46.35,45.72 44.45,43.81 44.45,43.18 | v41.91,27.94 41.91,28.57
  Top 0.61: 41.91,30.48 41.59,30.8 41.59,34.92 41.27,35.24 41.27,36.2 41.59,36.51 41.59,37.78 v41.91,38.1
  Top 0.813: v44.45,41.59 44.45,43.18
  Bottom 0.61: v41.91,38.1 v44.45,41.59
  Bottom 0.813: v41.91,27.94 42.55,27.3 42.55,10.79 41.91,10.16 29.21,10.16 26.67,7.62 ROWREGISTER1.14
V+
  pour Bottom (isolate 0.61): 0,80.01 0,0 100.33,0 100.33,80.01

### Text on the board
Top: + | RST | el09d2s | C8 | VOL | C1 | AUDIO
Bottom: + | RST | el09d2s | VOL | AUDIO